# Altium schematic sheet VoltageRegulator.SchDoc
size A4; SheetNumber: 1; SheetTotal: 4
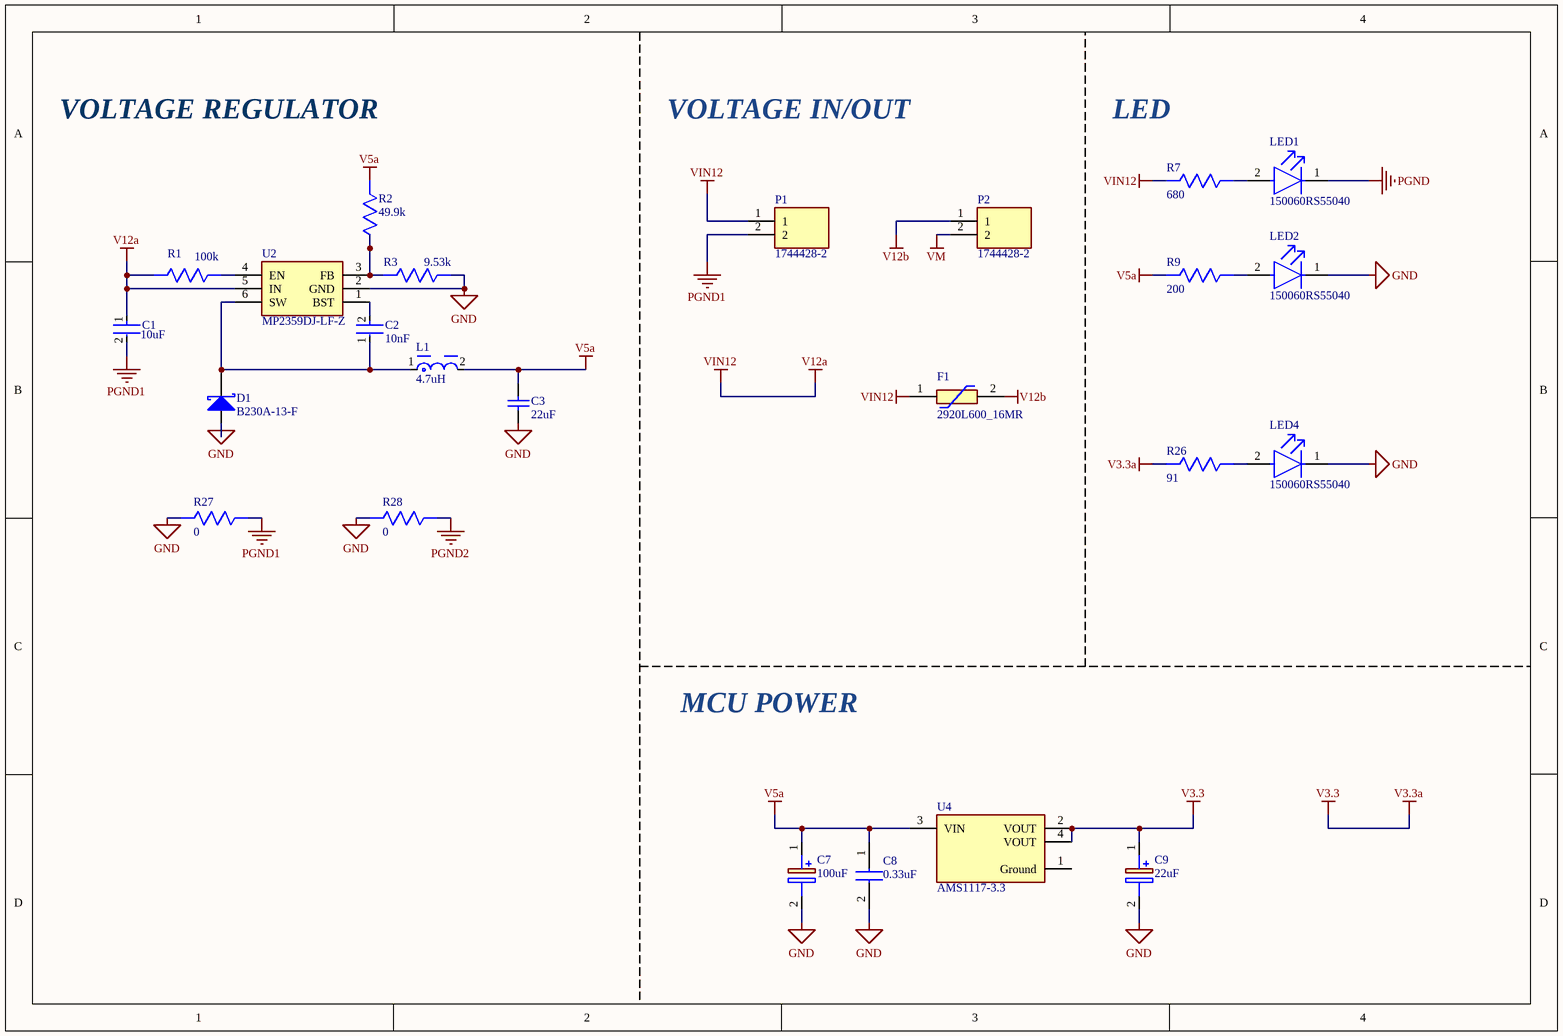
[diagram p0: VoltageRegulator.SchDoc]

## Parts
C1  10uF  [FP-C1608-080-IPC_A]
C2  10nF  [FP-C1608-080-0_1-MFG]
C3  22uF  [CAPC1608X100X20ML10]
C7  100uF  [T495E]
C8  0.33uF  [C1608_Commercial]
C9  22uF  [T495C]
D1  B230A-13-F  [DIOD-SMA-2_V]
F1  2920L600_16MR  [FUSC7451X160N]
L1  4.7uH  [FP-7440530047-MFG]
LED1  150060RS55040  [FP-150060RS55040-MFG]
LED2  150060RS55040  [FP-150060RS55040-MFG]
LED4  150060RS55040  [FP-150060RS55040-MFG]
P1  1744428-2  [17444282]
P2  1744428-2  [17444282]
R1  100k  [RESC1608X55N]
R2  49.9k  [RESC1608X55N]
R3  9.53k  [RESC1608X55N]
R7  680  [RESC1608X55N]
R9  200  [RESC1608X55N]
R26  91  [RESC1608X55N]
R27  0  [RESC1608X55N]
R28  0  [RESC1608X55N]
U2  MP2359DJ-LF-Z  [SOT95P280X100-6N]
U4  AMS1117-3.3  [FP-AMS1117-IPC_C]

## Nets
GND: C3.1 C7.2(-) C8.2 C9.2(-) D1.1(A) LED2.1(C) LED4.1(C) R3.2 R27.1 R28.1 U2.2(GND)
PGND: LED1.1(C)
PGND1: C1.2 P1.2 R27.2
PGND2: R28.2
V3.3: C9.1(+) R26.1 U4.2(VOUT) U4.4(VOUT)  [also labelled V3.3a]
V5a: C3.2 C7.1(+) C8.1 L1.2 R2.1 R9.1 U4.3(VIN)
V12a: C1.1 F1.1 P1.1 R1.1 R7.1 U2.5(IN)  [also labelled VIN12]
V12b: F1.2 P2.1
VM: P2.2
NetC2_1: C2.1 D1.2(K) L1.1 U2.6(SW)
NetC2_2: C2.2 U2.1(BST)
NetLED1_2: LED1.2(A) R7.2
NetLED2_2: LED2.2(A) R9.2
NetLED4_2: LED4.2(A) R26.2
NetR1_2: R1.2 U2.4(EN)
NetR2_2: R2.2 R3.1 U2.3(FB)

Not connected (* = marked no-connect by the designer): U4 1(Ground)

## Notes on the sheet
- VOLTAGE REGULATOR
- VOLTAGE IN/OUT
- LED
- MCU POWER

## Library data of the parts
C1 = CMP-2000-05442-2: CAP CER 10UF 25V X5R 0603; Dielectric Material: Ceramic; Tolerance: 20%; Dielectric: X5R; Length: 1.6mm; Termination: SMD/SMT; Depth: 0.8mm; RoHS Compliant: Yes; Construction: Flat; Weight: 7.1E-05oz; Thickness: 0.039inch; Packaging: Tape and Reel; Min Operating Temperature: -55°C; Case Code (Imperial): 0603; Case/Package: 0603; Height: 0.8mm; Case Code (Metric): 1608; Voltage Rating: 25V; Resistor Type: Ceramic; Voltage Rating (DC): 25V; Max Operating Temperature: 85°C; REACH SVHC: No SVHC; Lead Free: Lead Free; Series: C; Width: 0.8mm; Mount: Surface Mount; Package Quantity: 1; Capacitance: 10uF
C2 = CMP-08246-005687-1: Multilayer Ceramic Capacitors 10nF ±20% 50V X5R SMD 0603; Width: 0.031inch; Termination: SMD/SMT; Mount: Surface Mount; Voltage Rating (DC): 50V; Max Operating Temperature: 85°C; Case/Package: 0603; Dielectric: X5R; Length: 0.063inch; Package Quantity: 4000; Case Code (Metric): 1608; Capacitance: 10nF; Packaging: Tape and Reel; Lead Free: Lead Free; Tolerance: 20%; Case Code (Imperial): 0603; Resistor Type: Ceramic; Height: 0.8mm; Dielectric Material: Ceramic; RoHS Compliant: Yes; Min Operating Temperature: -55°C; Series: C; Voltage Rating: 50V; Thickness: 0.035inch
C3 = CMP-2000-05441-1: Chip Capacitor, 22 uF, +/- 20%, 10 V, -55 to 85 degC, 0603 (1608 Metric), RoHS, Tape and Reel; Manufacturer: TDK; PCN Part Number: MLCCPartNumberChange30/Nov/2012; Voltage - Rated: 10V; Product Training Modules: CSeriesGeneralApplicationsSEAT,CCV,andTVCLDesignToolsGuidetoReplacinganElectrolyticCapacitorwithanMLCC; Other Names: 445-9077-1; Design Resources: 20WNon-IsolatedBuckLEDDriverUsingPLLNK460KG; Online Catalog: CSeries,GeneralPurpose; Capacitance: 22µF; Temperature Coefficient: X5R; Kits: 445-9014-KIT-ND-KITMLCC100PF-22UF060310-50V; Packaging: CutTape(CT); Standard Package: 1; Package / Case: 0603(1608Metric); Lead Style: -; Features: -; Ratings: -; Operating Temperature: -55degC~85degC; Applications: GeneralPurpose; Package Reference: 603; Datasheet URL: http://download.siliconexpert.com/pdfs/2015/4/21/15/54/45/779/tdk_/manual/37024850441143360mlcc_commercial_general_en.pdf; Datasheet Version: Mar-15; Mounting Type: SurfaceMount,MLCC; Lead Spacing: -; Size / Dimension: 0.063"Lx0.031"W(1.60mmx0.80mm); Height - Seated (Max): -; Package Description: 2-Pin Surface Mount Device, Body 1.6 x 0.8 mm; Manufacturer URL: http://www.tdk.com/; RoHS Information: RoHSCertificate-MLCC; Tolerance: ±20%; Series: C; Thickness (Max): 0.035"(0.90mm); Family: CeramicCapacitors; Category: Capacitors
C7 = T495E107K025ATE100: Capacitor Polarised; Manufacturer_Name: KEMET; Datasheet Link: https://content.kemet.com/datasheets/KEM_T2009_T495.pdf; Height: 3.8mm; Manufacturer_Part_Number: T495E107K025ATE100; Mouser Part Number: 80-T495E107K025; Mouser Price/Stock: https://www.mouser.co.uk/ProductDetail/KEMET/T495E107K025ATE100?qs=m0jdfl4MgCkmn%2F5ccqVs1Q%3D%3D; Arrow Part Number: T495E107K025ATE100; Arrow Price/Stock: https://www.arrow.com/en/products/t495e107k025ate100/kemet-corporation
C8 = C1608X7R1H334K080AC: Capacitor; Manufacturer_Name: TDK; Datasheet Link: https://product.tdk.com/system/files/dam/doc/product/capacitor/ceramic/mlcc/catalog/mlcc_commercial_general_en.pdf; Height: 0.9mm; Manufacturer_Part_Number: C1608X7R1H334K080AC; Mouser Part Number: 810-C1608X7R1H334K; Mouser Price/Stock: https://www.mouser.co.uk/ProductDetail/TDK/C1608X7R1H334K080AC?qs=NRhsANhppD%252BuOqJgCMjUlg%3D%3D; Arrow Part Number: C1608X7R1H334K080AC; Arrow Price/Stock: https://www.arrow.com/en/products/c1608x7r1h334k080ac/tdk
C9 = T495C226K025ATE300: Capacitor Polarised; Manufacturer_Name: KEMET; Datasheet Link: https://content.kemet.com/datasheets/KEM_T2009_T495.pdf; Height: 2.8mm; Manufacturer_Part_Number: T495C226K025ATE300; Mouser Part Number: 80-T495C226K25E300; Mouser Price/Stock: https://www.mouser.co.uk/ProductDetail/KEMET/T495C226K025ATE300?qs=bQqEcw2qv2Rc8vCMsxIK1A%3D%3D; Arrow Part Number: T495C226K025ATE300; Arrow Price/Stock: https://www.arrow.com/en/products/t495c226k025ate300/kemet-corporation
D1 = CMP-0905-00001-1: 2 A Surface Mount Schottky Barrier Rectifier, 30 V, -65 to 150 degC, 2-Pin SMA, RoHS, Tape and Reel; Manufacturer: Diodes Inc; VRRM: 30 V; IO: 2 A Max.; CT: 200 pF; IFSM: 50 A; VF: 0.5 V; IF: 2 A; ComponentLink1Description: Manufacturer URL; PackageDescription: 2-Pin SMA, Body 4.3 x 2.605 mm, Height 2.3 mm; Mounting Technology: Surface Mount; ComponentLink1URL: http://diodes.com/; VR: 30 V; PackageReference: SMA-2; RoHS: TRUE; ComponentLink2URL: http://diodes.com/datasheets/ds13004.pdf; Packing: Tape and Reel; DatasheetVersion: Rev. 21 - 2; ComponentLink2Description: Datasheet; Temperature Range: -65 to 150 degC; PartNumber: B230A-13-F
F1 = 2920L600_16MR: Resettable Fuse; Manufacturer_Name: LITTELFUSE; Manufacturer_Part_Number: 2920L600/16MR; Datasheet Link: https://m.littelfuse.com/~/media/electronics/datasheets/resettable_ptcs/littelfuse_ptc_2920l_datasheet.pdf.pdf; Height: 1.6mm
L1 = CMP-0227-00415-2: FIXED IND 4.7UH 2.4A 38 MOHM SMD; Max DC Current: 2A; Series Resistance: 38mR; Core Material: Ferrite; Inductance Tolerance: 30%; Shielding: Shielded; Self Resonant Frequency: 40MHz; Test Frequency: 100kHz; Saturation Current: 1.95A; Case/Package: 2323; Resistor Type: Wirewound; Case Code (Imperial): 2323; Depth: 5.8mm; Mount: Surface Mount; Case Code (Metric): 5858; Min Operating Temperature: -40°C; RoHS Compliant: Yes; Series: WE-TPC; Lead Free: Lead Free; Height: 2.8mm; RMS Current (Irms): 2.4A; Weight: 0.013334oz; Packaging: Cut Tape; Width: 5.8mm; Height - Seated (Max): 0.118inch; Package Quantity: 1; Number of Pins: 2; Termination: SMD/SMT; Inductance: 4.7uH; Max Operating Temperature: 125°C; Length: 5.8mm; Current Rating: 2.4A; Tolerance: 30%; DC Resistance (DCR): 38mR
LED1 LED2 LED4 = CMP-207942-000007-1: LED RED DIFFUSED 0603 SMD; Lens Style: Flat; Lens Size: 0.8mm; Luminous Intensity: 90mcd; Test Current: 20mA; Forward Voltage: 2V; Dominant Wavelength: 624nm; Viewing Angle: 140°; Width: 0.8mm; Mount: Surface Mount; Height: 0.5mm; Case/Package: 0603; Packaging: Cut Tape; Length: 1.6mm; RoHS Compliant: No; Color: Red; Case Code (Imperial): 0603; Lens Transparency: Diffused; Case Code (Metric): 1608
P1 P2 = 1744428-2: Connector; Manufacturer_Name: TE Connectivity; Datasheet Link: https://www.te.com/commerce/DocumentDelivery/DDEController?Action=srchrtrv&DocNm=1744428&DocType=Customer+Drawing&DocLang=English; Height: 8.8mm; Manufacturer_Part_Number: 1744428-2; Mouser Part Number: 571-1744428-2; Mouser Price/Stock: https://www.mouser.co.uk/ProductDetail/TE-Connectivity/1744428-2?qs=%2F6W%2F9%2FHWvcDoOfykajFB2Q%3D%3D
R1-R3 R7 R9 R26-R28 = CMP0603-FX-1003ELF: Resistor; Manufacturer_Name: Bourns; Datasheet Link: https://www.mouser.co.uk/datasheet/2/54/Bourns_CMP_Datasheet_05.28.20-1854233.pdf; Height: 0.55mm; Manufacturer_Part_Number: CMP0603-FX-1003ELF
U2 = MP2359DJ-LF-Z: Integrated Circuit; Manufacturer_Name: Monolithic Power Systems (MPS); Datasheet Link: https://componentsearchengine.com//MP2359DJ-LF-Z.pdf; Height: 1mm; Mouser2 Part Number: 946-MP2359DJLFZ; Mouser2 Price/Stock: https://www.mouser.com/Search/Refine.aspx?Keyword=946-MP2359DJLFZ; Manufacturer_Part_Number: MP2359DJ-LF-Z
U4 = CMP-209535-000001-1: LDO Voltage Regulators 1A, 3.3V; Manufacturer: Advanced Monolithic Systems; Dropout Voltage: 1.1V; Output Type: Fixed; Nominal Supply Current: 5mA; Max Power Dissipation: 1.2W; Max Supply Voltage: 15V; Number Of Outputs: 1; Standoff Height: 0.64mm; Max Junction Temp: +125°C; Height: 1.8mm; Package: AMS1117; Device Class L2: Power Management ICs; ComponentLink2Description: Datasheet; ComponentLink2URL: http://www.advanced-monolithic.com/pdf/ds1117.pdf; Category: IC; RoHS: TRUE; Automotive: No; Device Class L1: Integrated Circuits (ICs); Output Current: 1A; Device Class L3: Voltage Regulators - Linear; Temperature: -40°C to +125°C; Output Voltage: 3.3V; Manufacturer Part Number: AMS1117-3.3; Temperature Range Low: -40°C; Octopart: https://octopart.com/ams1117-3.3-advanced+monolithic+systems-25899300; Lead Free: Yes; Ipc Land Pattern Name: SOT229P700X180-4; Temperature Range High: +125°C